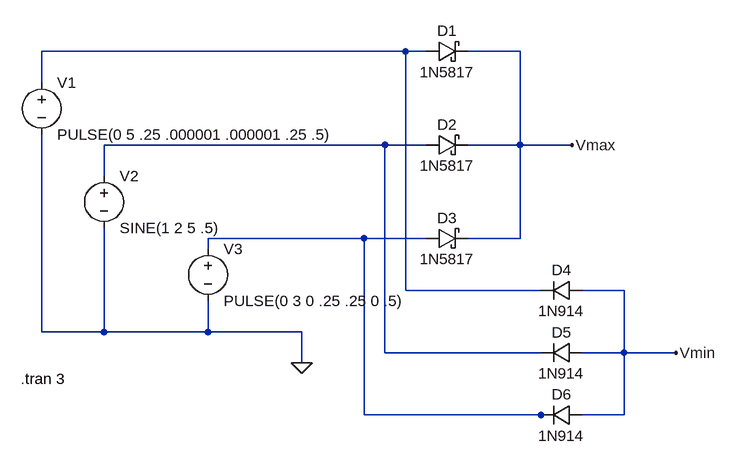
[diagram p0: schematic diode-max.asc]
diode-max.asc, the LTspice schematic file:
Version 4
SHEET 1 880 688
WIRE 224 80 -336 80
WIRE 256 80 224 80
WIRE 400 80 320 80
WIRE -336 128 -336 80
WIRE 192 224 -240 224
WIRE 256 224 192 224
WIRE 400 224 400 80
WIRE 400 224 320 224
WIRE 480 224 400 224
WIRE -240 272 -240 224
WIRE 160 368 -80 368
WIRE 256 368 160 368
WIRE 400 368 400 224
WIRE 400 368 320 368
WIRE -80 384 -80 368
WIRE 224 448 224 80
WIRE 432 448 224 448
WIRE 560 448 496 448
WIRE -336 512 -336 208
WIRE -240 512 -240 352
WIRE -240 512 -336 512
WIRE -80 512 -80 464
WIRE -80 512 -240 512
WIRE 64 512 -80 512
WIRE 192 544 192 224
WIRE 432 544 192 544
WIRE 560 544 560 448
WIRE 560 544 496 544
WIRE 640 544 560 544
WIRE 64 560 64 512
WIRE 160 640 160 368
WIRE 432 640 160 640
WIRE 448 640 432 640
WIRE 560 640 560 544
WIRE 560 640 496 640
FLAG 64 560 0
FLAG 480 224 Vmax
FLAG 640 544 Vmin
SYMBOL schottky 256 96 R270
WINDOW 0 32 32 VTop 2
WINDOW 3 0 32 VBottom 2
SYMATTR InstName D1
SYMATTR Value 1N5817
SYMATTR Description Diode
SYMATTR Type diode
SYMBOL schottky 256 240 R270
WINDOW 0 32 32 VTop 2
WINDOW 3 0 32 VBottom 2
SYMATTR InstName D2
SYMATTR Value 1N5817
SYMATTR Description Diode
SYMATTR Type diode
SYMBOL schottky 256 384 R270
WINDOW 0 32 32 VTop 2
WINDOW 3 0 32 VBottom 2
SYMATTR InstName D3
SYMATTR Value 1N5817
SYMATTR Description Diode
SYMATTR Type diode
SYMBOL voltage -336 112 R0
WINDOW 123 0 0 Left 2
WINDOW 39 0 0 Left 2
SYMATTR InstName V1
SYMATTR Value PULSE(0 5 .25 .000001 .000001 .25 .5)
SYMBOL voltage -240 256 R0
WINDOW 123 0 0 Left 2
WINDOW 39 0 0 Left 2
SYMATTR InstName V2
SYMATTR Value SINE(1 2 5 .5)
SYMBOL voltage -80 368 R0
WINDOW 123 0 0 Left 2
WINDOW 39 0 0 Left 2
SYMATTR InstName V3
SYMATTR Value PULSE(0 3 0 .25 .25 0 .5)
SYMBOL diode 496 432 R90
WINDOW 0 0 32 VBottom 2
WINDOW 3 32 32 VTop 2
SYMATTR InstName D4
SYMATTR Value 1N914
SYMBOL diode 496 528 R90
WINDOW 0 0 32 VBottom 2
WINDOW 3 32 32 VTop 2
SYMATTR InstName D5
SYMATTR Value 1N914
SYMBOL diode 496 624 R90
WINDOW 0 0 32 VBottom 2
WINDOW 3 32 32 VTop 2
SYMATTR InstName D6
SYMATTR Value 1N914
TEXT -368 584 Left 2 !.tran 3

The netlist it stands for:
* diode-max.asc
D1 N001 Vmax 1N5817
D2 N002 Vmax 1N5817
D3 N003 Vmax 1N5817
V1 N001 0 PULSE(0 5 .25 .000001 .000001 .25 .5)
V2 N002 0 SINE(1 2 5 .5)
V3 N003 0 PULSE(0 3 0 .25 .25 0 .5)
D4 Vmin N001 1N914
D5 Vmin N002 1N914
D6 Vmin N003 1N914
.model D D
.lib standard.dio
.tran 3
.backanno
.end